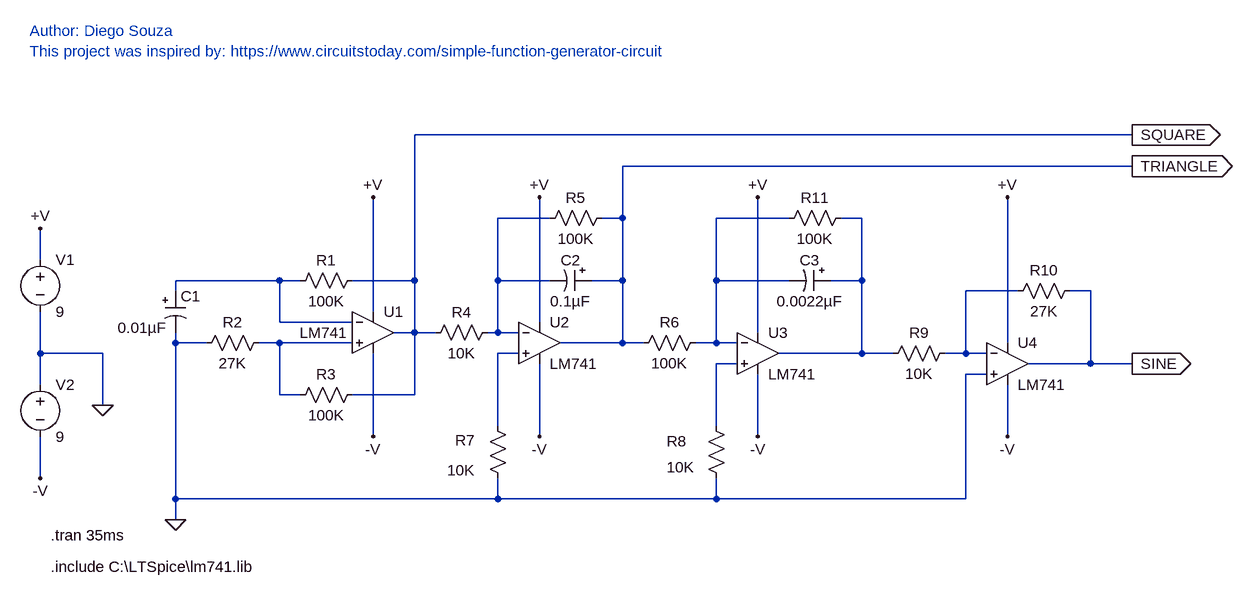
[diagram p0: schematic simple_function_generator_ds.asc]
simple_function_generator_ds.asc, the LTspice schematic file:
Version 4
SHEET 1 1748 680
WIRE 1328 -160 224 -160
WIRE 1328 -112 544 -112
WIRE 432 -32 352 -32
WIRE 544 -32 544 -112
WIRE 544 -32 512 -32
WIRE 800 -32 688 -32
WIRE 912 -32 880 -32
WIRE -352 32 -352 -16
WIRE 16 64 -144 64
WIRE 48 64 16 64
WIRE 224 64 224 -160
WIRE 224 64 128 64
WIRE 352 64 352 -32
WIRE 432 64 352 64
WIRE 544 64 544 -32
WIRE 544 64 496 64
WIRE 688 64 688 -32
WIRE 800 64 688 64
WIRE 912 64 912 -32
WIRE 912 64 864 64
WIRE -144 80 -144 64
WIRE 1152 80 1072 80
WIRE 1264 80 1232 80
WIRE 160 112 160 -64
WIRE 16 128 16 64
WIRE 128 128 16 128
WIRE 416 128 416 -64
WIRE 224 144 224 64
WIRE 224 144 192 144
WIRE 256 144 224 144
WIRE 352 144 352 64
WIRE 352 144 336 144
WIRE 384 144 352 144
WIRE 752 144 752 -64
WIRE -144 160 -144 144
WIRE -96 160 -144 160
WIRE 16 160 -16 160
WIRE 128 160 16 160
WIRE 544 160 544 64
WIRE 544 160 448 160
WIRE 576 160 544 160
WIRE 688 160 688 64
WIRE 688 160 656 160
WIRE 720 160 688 160
WIRE 1136 160 1136 -64
WIRE -352 176 -352 112
WIRE -256 176 -352 176
WIRE 384 176 352 176
WIRE 912 176 912 64
WIRE 912 176 784 176
WIRE 960 176 912 176
WIRE 1072 176 1072 80
WIRE 1072 176 1040 176
WIRE 1104 176 1072 176
WIRE 720 192 688 192
WIRE 1264 192 1264 80
WIRE 1264 192 1168 192
WIRE 1328 192 1264 192
WIRE 1104 208 1072 208
WIRE -352 224 -352 176
WIRE 16 240 16 160
WIRE 48 240 16 240
WIRE 224 240 224 144
WIRE 224 240 128 240
WIRE -256 256 -256 176
WIRE 352 288 352 176
WIRE 688 288 688 192
WIRE 160 304 160 176
WIRE 416 304 416 192
WIRE 752 304 752 208
WIRE 1136 304 1136 224
WIRE -352 368 -352 304
WIRE -144 400 -144 160
WIRE 352 400 352 368
WIRE 352 400 -144 400
WIRE 688 400 688 368
WIRE 688 400 352 400
WIRE 1072 400 1072 208
WIRE 1072 400 688 400
WIRE -144 432 -144 400
FLAG -144 432 0
FLAG -352 -16 +V
FLAG -352 368 -V
FLAG 160 -64 +V
FLAG 160 304 -V
FLAG 1328 -160 SQUARE
IOPIN 1328 -160 Out
FLAG 1328 -112 TRIANGLE
IOPIN 1328 -112 Out
FLAG 1328 192 SINE
IOPIN 1328 192 Out
FLAG 416 -64 +V
FLAG 416 304 -V
FLAG 752 -64 +V
FLAG 752 304 -V
FLAG 1136 -64 +V
FLAG 1136 304 -V
FLAG -256 256 0
SYMBOL res 144 224 R90
WINDOW 0 0 56 VBottom 2
WINDOW 3 32 56 VTop 2
SYMATTR InstName R3
SYMATTR Value 100K
SYMBOL res 0 144 R90
WINDOW 0 0 56 VBottom 2
WINDOW 3 32 56 VTop 2
SYMATTR InstName R2
SYMATTR Value 27K
SYMBOL res 144 48 R90
WINDOW 0 0 56 VBottom 2
WINDOW 3 32 56 VTop 2
SYMATTR InstName R1
SYMATTR Value 100K
SYMBOL voltage -352 16 R0
WINDOW 123 0 0 Left 0
WINDOW 39 24 124 Left 2
SYMATTR InstName V1
SYMATTR Value 9
SYMBOL voltage -352 208 R0
WINDOW 123 0 0 Left 0
WINDOW 39 24 124 Left 2
SYMATTR InstName V2
SYMATTR Value 9
SYMBOL res 352 128 R90
WINDOW 0 0 56 VBottom 2
WINDOW 3 32 56 VTop 2
SYMATTR InstName R4
SYMATTR Value 10K
SYMBOL polcap -160 80 R0
WINDOW 3 -73 57 Left 2
SYMATTR Value 0.01µF
SYMATTR InstName C1
SYMBOL polcap 496 48 R90
WINDOW 0 0 32 VBottom 2
WINDOW 3 32 32 VTop 2
SYMATTR InstName C2
SYMATTR Value 0.1µF
SYMBOL res 528 -48 R90
WINDOW 0 0 56 VBottom 2
WINDOW 3 32 56 VTop 2
SYMATTR InstName R5
SYMATTR Value 100K
SYMBOL res 336 272 R0
WINDOW 0 -50 38 Left 2
WINDOW 3 -62 84 Left 2
SYMATTR InstName R7
SYMATTR Value 10K
SYMBOL res 1056 160 R90
WINDOW 0 0 56 VBottom 2
WINDOW 3 32 56 VTop 2
SYMATTR InstName R9
SYMATTR Value 10K
SYMBOL res 1248 64 R90
WINDOW 0 0 56 VBottom 2
WINDOW 3 32 56 VTop 2
SYMATTR InstName R10
SYMATTR Value 27K
SYMBOL res 560 176 R270
WINDOW 0 32 56 VTop 2
WINDOW 3 0 56 VBottom 2
SYMATTR InstName R6
SYMATTR Value 100K
SYMBOL res 896 -48 R90
WINDOW 0 0 56 VBottom 2
WINDOW 3 32 56 VTop 2
SYMATTR InstName R11
SYMATTR Value 100K
SYMBOL polcap 864 48 R90
WINDOW 0 0 32 VBottom 2
WINDOW 3 32 32 VTop 2
SYMATTR InstName C3
SYMATTR Value 0.0022µF
SYMBOL res 672 272 R0
WINDOW 0 -60 39 Left 2
WINDOW 3 -60 79 Left 2
SYMATTR InstName R8
SYMATTR Value 10K
SYMBOL OpAmps\\opamp2 160 80 R0
WINDOW 3 -113 64 Left 2
SYMATTR Value LM741
SYMATTR InstName U1
SYMBOL OpAmps\\opamp2 416 96 R0
SYMATTR InstName U2
SYMATTR Value LM741
SYMBOL OpAmps\\opamp2 752 112 R0
SYMATTR InstName U3
SYMATTR Value LM741
SYMBOL OpAmps\\opamp2 1136 128 R0
SYMATTR InstName U4
SYMATTR Value LM741
TEXT -336 456 Left 2 !.tran 35ms
TEXT -336 504 Left 2 !.include C:\\LTSpice\\lm741.lib
TEXT -368 -320 Left 2 ;Author: Diego Souza \nThis project was inspired by: https://www.circuitstoday.com/simple-function-generator-circuit

The netlist it stands for:
* simple_function_generator_ds.asc
R3 SQUARE N006 100K
R2 N006 0 27K
R1 SQUARE N004 100K
V1 +V 0 9
V2 0 -V 9
R4 N001 SQUARE 10K
C1 N004 0 0.01µF
C2 TRIANGLE N001 0.1µF
R5 TRIANGLE N001 100K
R7 N007 0 10K
R9 N005 N003 10K
R10 SINE N005 27K
R6 TRIANGLE N002 100K
R11 N003 N002 100K
C3 N003 N002 0.0022µF
R8 N008 0 10K
XU1 N006 N004 +V -V SQUARE LM741  ; pins In+ In- V+ V- OUT
XU2 N007 N001 +V -V TRIANGLE LM741  ; pins In+ In- V+ V- OUT
XU3 N008 N002 +V -V N003 LM741  ; pins In+ In- V+ V- OUT
XU4 0 N005 +V -V SINE LM741  ; pins In+ In- V+ V- OUT
.tran 35ms
.include C:\LTSpice\lm741.lib
* Author: Diego Souza
* This project was inspired by: https://www.circuitstoday.com/simple-function-generator-circuit
.backanno
.end